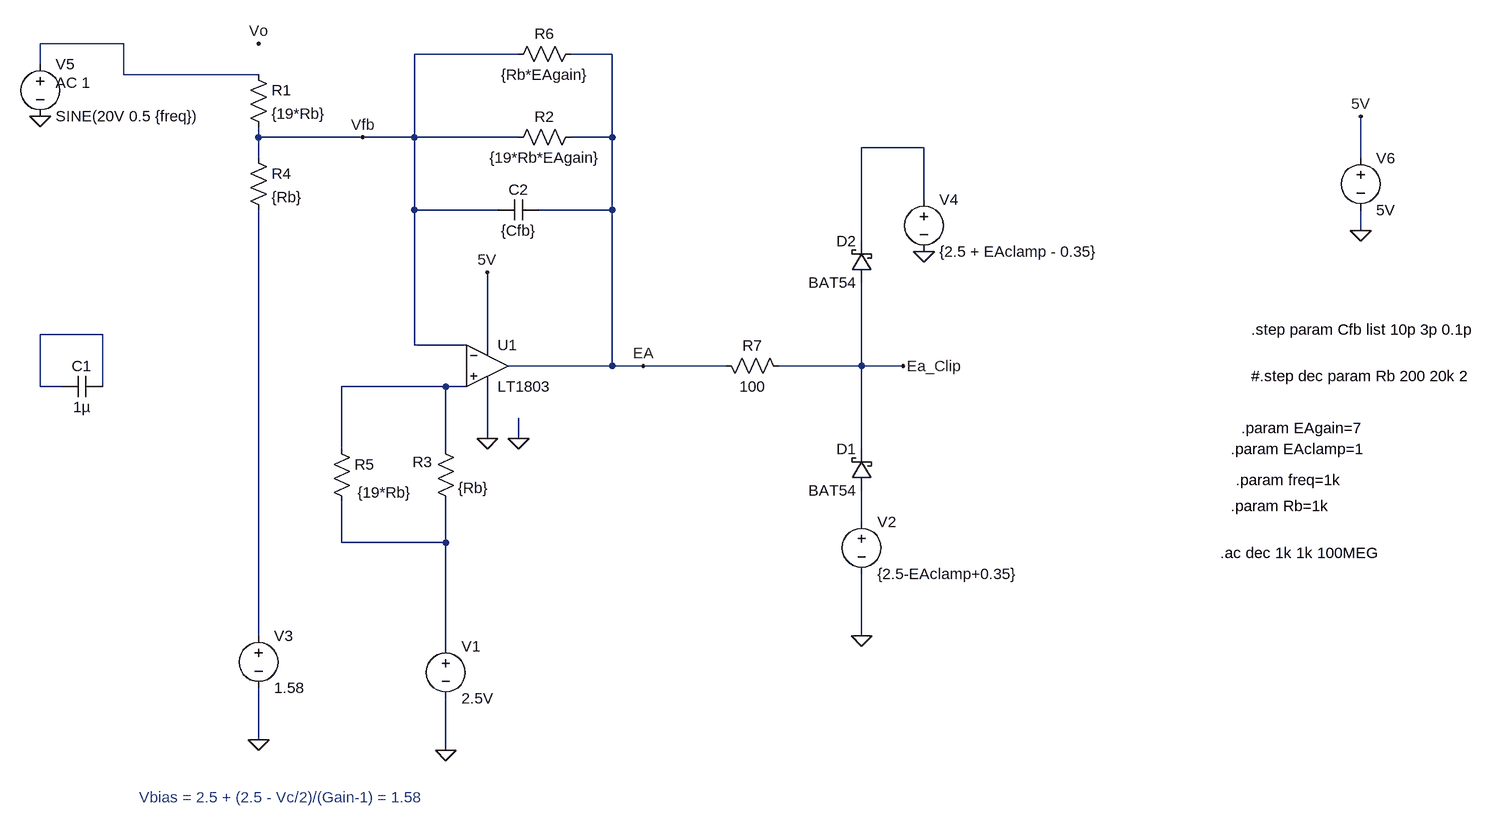
[diagram p0: schematic Error-amplifier-sweep.asc]
Error-amplifier-sweep.asc, the LTspice schematic file:
Version 4
SHEET 1 2336 988
WIRE 224 -208 96 -208
WIRE 832 -192 672 -192
WIRE 976 -192 912 -192
WIRE 96 -176 96 -208
WIRE 224 -160 224 -208
WIRE 432 -160 224 -160
WIRE 432 -64 432 -80
WIRE 592 -64 432 -64
WIRE 672 -64 672 -192
WIRE 672 -64 592 -64
WIRE 832 -64 672 -64
WIRE 976 -64 976 -192
WIRE 976 -64 912 -64
WIRE 1456 -48 1360 -48
WIRE 432 -32 432 -64
WIRE 2128 -32 2128 -96
WIRE 1456 32 1456 -48
WIRE 672 48 672 -64
WIRE 800 48 672 48
WIRE 976 48 976 -64
WIRE 976 48 864 48
WIRE 2128 80 2128 48
WIRE 1360 96 1360 -48
WIRE 192 240 96 240
WIRE 672 256 672 48
WIRE 752 256 672 256
WIRE 784 256 784 144
WIRE 752 272 752 256
WIRE 976 288 976 48
WIRE 976 288 816 288
WIRE 1024 288 976 288
WIRE 1152 288 1024 288
WIRE 1360 288 1360 160
WIRE 1360 288 1232 288
WIRE 1424 288 1360 288
WIRE 96 320 96 240
WIRE 128 320 96 320
WIRE 192 320 192 240
WIRE 720 320 560 320
WIRE 752 320 752 304
WIRE 752 320 720 320
WIRE 784 400 784 320
WIRE 832 400 832 368
WIRE 560 416 560 320
WIRE 720 416 720 320
WIRE 1360 416 1360 288
WIRE 1360 528 1360 480
WIRE 560 560 560 496
WIRE 720 560 720 496
WIRE 720 560 560 560
WIRE 432 704 432 48
WIRE 1360 704 1360 608
WIRE 720 720 720 560
WIRE 432 864 432 784
WIRE 720 880 720 800
FLAG 784 400 0
FLAG 832 400 0
FLAG 784 144 5V
FLAG 432 -208 Vo
FLAG 720 880 0
FLAG 1024 288 EA
FLAG 1360 704 0
FLAG 432 864 0
FLAG 1456 112 0
FLAG 1424 288 Ea_Clip
FLAG 96 -96 0
FLAG 592 -64 Vfb
FLAG 2128 80 0
FLAG 2128 -96 5V
DATAFLAG 1120 288 ""
DATAFLAG 624 320 ""
DATAFLAG 672 160 ""
SYMBOL res 416 -176 R0
SYMATTR InstName R1
SYMATTR Value {19*Rb}
SYMBOL res 816 -48 R270
WINDOW 0 32 56 VTop 2
WINDOW 3 0 56 VBottom 2
SYMATTR InstName R2
SYMATTR Value {19*Rb*EAgain}
SYMBOL res 736 512 R180
WINDOW 0 36 76 Left 2
WINDOW 3 -50 36 Left 2
SYMATTR InstName R3
SYMATTR Value {Rb}
SYMBOL res 416 -48 R0
SYMATTR InstName R4
SYMATTR Value {Rb}
SYMBOL voltage 720 704 R0
WINDOW 123 0 0 Left 0
WINDOW 39 0 0 Left 0
SYMATTR InstName V1
SYMATTR Value 2.5V
SYMBOL schottky 1376 480 R180
WINDOW 0 24 64 Left 2
WINDOW 3 24 0 Left 2
SYMATTR InstName D1
SYMATTR Value BAT54
SYMATTR Description Diode
SYMATTR Type diode
SYMBOL voltage 1360 512 R0
WINDOW 123 0 0 Left 0
WINDOW 39 0 0 Left 0
SYMATTR InstName V2
SYMATTR Value {2.5-EAclamp+0.35}
SYMBOL res 544 400 R0
WINDOW 3 40 83 Left 2
SYMATTR Value {19*Rb}
SYMATTR InstName R5
SYMBOL voltage 432 688 R0
WINDOW 123 0 0 Left 0
WINDOW 39 0 0 Left 0
SYMATTR InstName V3
SYMATTR Value 1.58
SYMBOL cap 192 304 R90
WINDOW 0 0 32 VBottom 2
WINDOW 3 32 32 VTop 2
SYMATTR InstName C1
SYMATTR Value 1µ
SYMBOL schottky 1376 160 R180
WINDOW 0 24 64 Left 2
WINDOW 3 24 0 Left 2
SYMATTR InstName D2
SYMATTR Value BAT54
SYMATTR Description Diode
SYMATTR Type diode
SYMBOL voltage 1456 16 R0
WINDOW 123 0 0 Left 0
WINDOW 39 0 0 Left 0
SYMATTR InstName V4
SYMATTR Value {2.5 + EAclamp - 0.35}
SYMBOL res 816 -176 R270
WINDOW 0 32 56 VTop 2
WINDOW 3 0 56 VBottom 2
SYMATTR InstName R6
SYMATTR Value {Rb*EAgain}
SYMBOL voltage 96 -192 R0
WINDOW 123 24 44 Left 2
WINDOW 39 0 0 Left 0
SYMATTR Value2 AC 1
SYMATTR InstName V5
SYMATTR Value SINE(20V 0.5 {freq})
SYMBOL res 1136 272 M90
WINDOW 0 0 56 VBottom 2
WINDOW 3 32 56 VTop 2
SYMATTR InstName R7
SYMATTR Value 100
SYMBOL voltage 2128 -48 R0
WINDOW 123 0 0 Left 0
WINDOW 39 0 0 Left 0
SYMATTR InstName V6
SYMATTR Value 5V
SYMBOL OpAmps\\LT1803 784 288 R0
SYMATTR InstName U1
SYMBOL cap 864 32 R90
WINDOW 0 0 32 VBottom 2
WINDOW 3 32 32 VTop 2
SYMATTR InstName C2
SYMATTR Value {Cfb}
TEXT 248 952 Left 2 ;Vbias = 2.5 + (2.5 - Vc/2)/(Gain-1) = 1.58
TEXT 1912 576 Left 2 !.ac dec 1k 1k 100MEG
TEXT 1928 416 Left 2 !.param EAclamp=1
TEXT 1944 384 Left 2 !.param EAgain=7
TEXT 1928 504 Left 2 !.param Rb=1k
TEXT 1960 304 Left 2 !#.step dec param Rb 200 20k 2
TEXT 1936 464 Left 2 !.param freq=1k
TEXT 1960 232 Left 2 !.step param Cfb list 10p 3p 0.1p

The netlist it stands for:
* Error-amplifier-sweep.asc
R1 N001 Vfb {19*Rb}
R2 Vfb EA {19*Rb*EAgain}
R3 N006 N004 {Rb}
R4 Vfb N007 {Rb}
V1 N006 0 2.5V
D1 N005 Ea_Clip BAT54
V2 N005 0 {2.5-EAclamp+0.35}
R5 N004 N006 {19*Rb}
V3 N007 0 1.58
C1 N003 N003 1µ
D2 Ea_Clip N002 BAT54
V4 N002 0 {2.5 + EAclamp - 0.35}
R6 Vfb EA {Rb*EAgain}
V5 N001 0 SINE(20V 0.5 {freq}) AC 1
R7 EA Ea_Clip 100
V6 5V 0 5V
* U1: LT1803 (symbol OpAmps\LT1803 not available, pins judged from their places): In+=N004 In-=Vfb V+=5V V-=0 OUT=EA
C2 EA Vfb {Cfb}
.model D D
.lib standard.dio
* Vbias = 2.5 + (2.5 - Vc/2)/(Gain-1) = 1.58
.ac dec 1k 1k 100MEG
.param EAclamp=1
.param EAgain=7
.param Rb=1k
#.step dec param Rb 200 20k 2
.param freq=1k
.step param Cfb list 10p 3p 0.1p
.backanno
.end